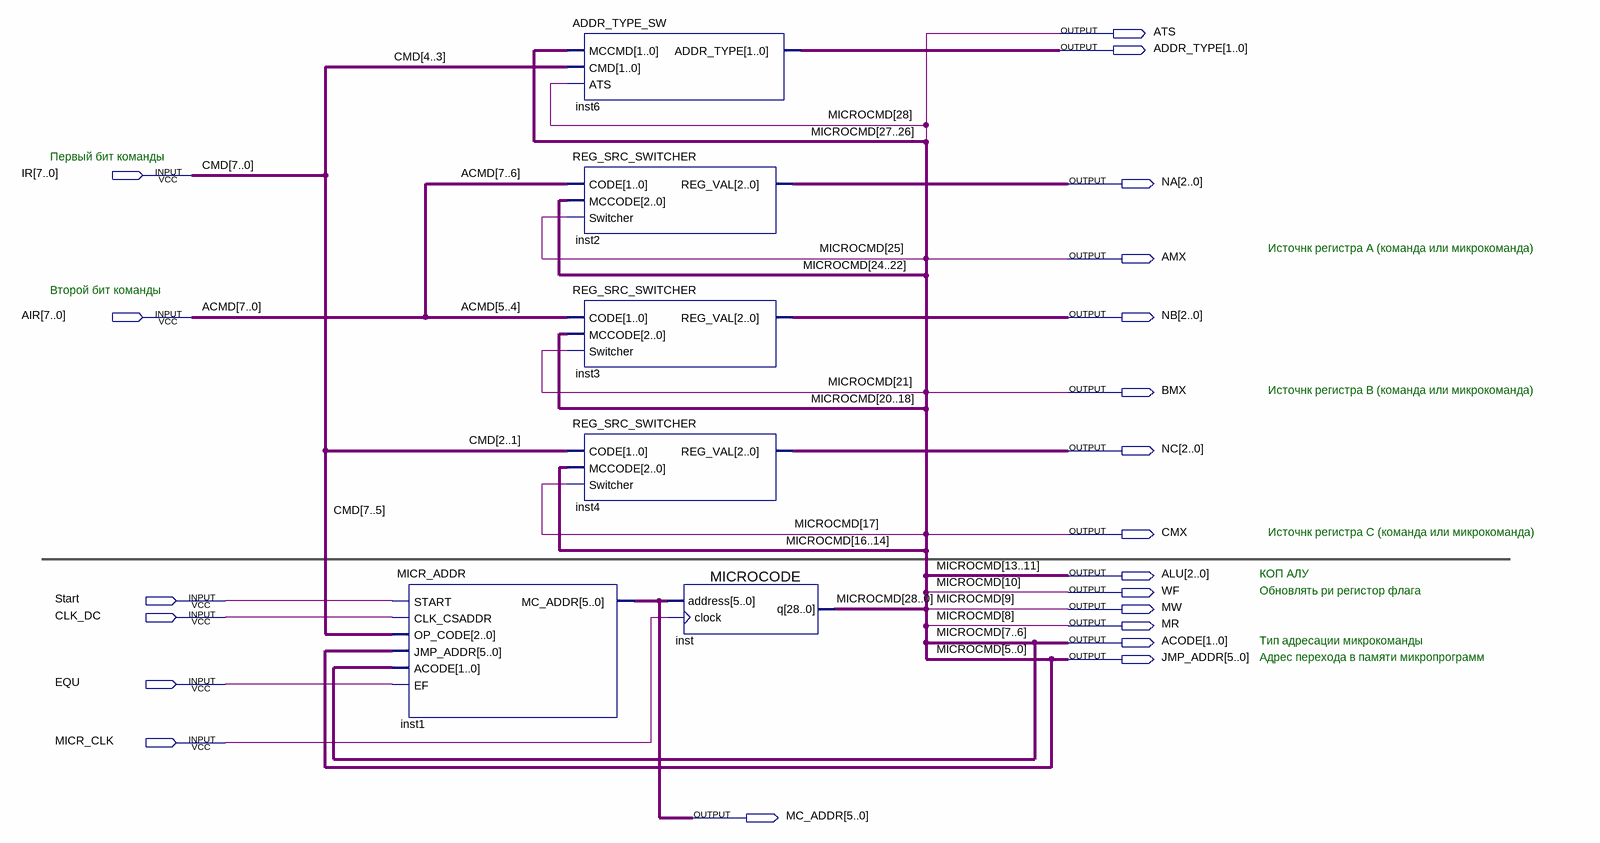
[diagram p0: schematic sheet]
// Quartus schematic CU.bdf as structural Verilog: 6 symbols, 21 pins
module CU (
  input  [7:0] IR,
  input  [7:0] AIR,
  input  Start,
  input  CLK_DC,
  input  EQU,
  input  MICR_CLK,
  output ATS,
  output [1:0] ADDR_TYPE,
  output [2:0] NA,
  output AMX,
  output [2:0] NB,
  output BMX,
  output [2:0] NC,
  output CMX,
  output [2:0] ALU,
  output WF,
  output MW,
  output MR,
  output [1:0] ACODE,
  output [5:0] JMP_ADDR,
  output [5:0] MC_ADDR
);

  wire [27:14] MICROCMD;

  MICR_ADDR inst1 (
    .START(Start), .CLK_CSADDR(CLK_DC), .OP_CODE(IR[7:5]), .JMP_ADDR(JMP_ADDR), .ACODE(ACODE), .EF(EQU),
    .MC_ADDR(MC_ADDR));
  ADDR_TYPE_SW inst6 (.MCCMD(MICROCMD[27:26]), .CMD(IR[4:3]), .ATS(ATS), .ADDR_TYPE(ADDR_TYPE));
  REG_SRC_SWITCHER inst2 (.CODE(AIR[7:6]), .MCCODE(MICROCMD[24:22]), .Switcher(MICROCMD[25]), .REG_VAL(NA));
  REG_SRC_SWITCHER inst3 (.CODE(AIR[5:4]), .MCCODE(MICROCMD[20:18]), .Switcher(MICROCMD[21]), .REG_VAL(NB));
  REG_SRC_SWITCHER inst4 (.CODE(IR[2:1]), .MCCODE(MICROCMD[16:14]), .Switcher(MICROCMD[17]), .REG_VAL(NC));
  MICROCODE inst (.address(MC_ADDR), .clock(MICR_CLK), .q({ATS, MICROCMD, ALU, WF, MW, MR, ACODE, JMP_ADDR}));

  // Other names for the same wires on the sheet: ACMD[7:0] = AIR; CMD[7:0] = IR;
  //   MICROCMD (some bits) = {ATS, ALU, WF, MW, MR, ACODE, JMP_ADDR}

  // Notes on the sheet:
  //   Первый бит команды
  //   Источнк регистра А (команда или микрокоманда)
  //   Второй бит команды
  //   Источнк регистра B (команда или микрокоманда)
  //   Источнк регистра C (команда или микрокоманда)
  //   КОП АЛУ
  //   Обновлять ри регистор флага
  //   Тип адресации микрокоманды
  //   Адрес перехода в памяти микропрограмм
endmodule
